# Altium project node24.PrjPcb (part 5 of 5)
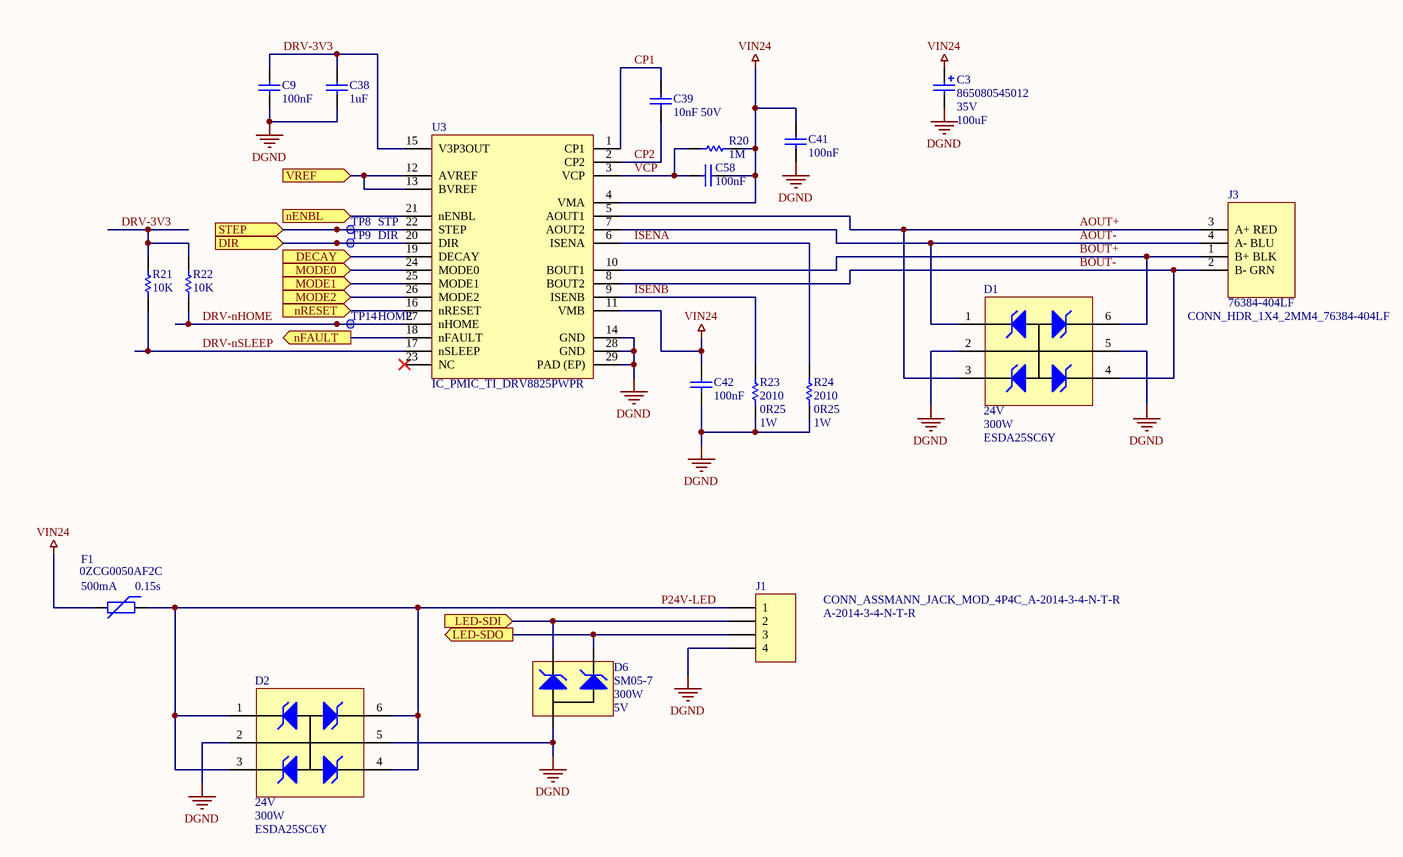
[diagram p6: node24-channel.SchDoc]

## Nets that join several sheets
DGND: node24-stm32f765bit6 (80 pins), node24-ethernet (22 pins), node24-power (19 pins), U_BANK-A (6 pins), U_BANK-A/U_CH-0 (16 pins), U_BANK-A/U_CH-4 (16 pins), U_BANK-A/U_CH-1 (16 pins), U_BANK-A/U_CH-5 (16 pins), U_BANK-A/U_CH-2 (16 pins), U_BANK-A/U_CH-6 (16 pins), U_BANK-A/U_CH-3 (16 pins), U_BANK-A/U_CH-7 (16 pins), U_BANK-B (6 pins), U_BANK-B/U_CH-0 (16 pins), U_BANK-B/U_CH-4 (16 pins), U_BANK-B/U_CH-1 (16 pins), U_BANK-B/U_CH-5 (16 pins), U_BANK-B/U_CH-2 (16 pins), U_BANK-B/U_CH-6 (16 pins), U_BANK-B/U_CH-3 (16 pins), U_BANK-B/U_CH-7 (16 pins), U_BANK-C (6 pins), U_BANK-C/U_CH-0 (16 pins), U_BANK-C/U_CH-4 (16 pins), U_BANK-C/U_CH-1 (16 pins), U_BANK-C/U_CH-5 (16 pins), U_BANK-C/U_CH-2 (16 pins), U_BANK-C/U_CH-6 (16 pins), U_BANK-C/U_CH-3 (16 pins), U_BANK-C/U_CH-7 (16 pins)
P3V3: node24-stm32f765bit6 (51 pins), node24-ethernet (8 pins), node24-power (5 pins), U_BANK-A (5 pins), U_BANK-B (5 pins), U_BANK-C (5 pins)
P5V0: node24-power (C47.1 C57.1 R2.2 U1.3), U_BANK-A (C14A.1 U4A.1), U_BANK-B (C14B.1 U4B.1), U_BANK-C (C14C.1 U4C.1)
VIN24: node24-power (8 pins), U_BANK-A/U_CH-0 (8 pins), U_BANK-A/U_CH-4 (8 pins), U_BANK-A/U_CH-1 (8 pins), U_BANK-A/U_CH-5 (8 pins), U_BANK-A/U_CH-2 (8 pins), U_BANK-A/U_CH-6 (8 pins), U_BANK-A/U_CH-3 (8 pins), U_BANK-A/U_CH-7 (8 pins), U_BANK-B/U_CH-0 (8 pins), U_BANK-B/U_CH-4 (8 pins), U_BANK-B/U_CH-1 (8 pins), U_BANK-B/U_CH-5 (8 pins), U_BANK-B/U_CH-2 (8 pins), U_BANK-B/U_CH-6 (8 pins), U_BANK-B/U_CH-3 (8 pins), U_BANK-B/U_CH-7 (8 pins), U_BANK-C/U_CH-0 (8 pins), U_BANK-C/U_CH-4 (8 pins), U_BANK-C/U_CH-1 (8 pins), U_BANK-C/U_CH-5 (8 pins), U_BANK-C/U_CH-2 (8 pins), U_BANK-C/U_CH-6 (8 pins), U_BANK-C/U_CH-3 (8 pins), U_BANK-C/U_CH-7 (8 pins)
DRV-BANKA-DECAY: node24-stm32f765bit6 (R48.2), U_BANK-A/U_CH-0 (U3A.19), U_BANK-A/U_CH-4 (U3B.19), U_BANK-A/U_CH-1 (U3C.19), U_BANK-A/U_CH-5 (U3D.19), U_BANK-A/U_CH-2 (U3E.19), U_BANK-A/U_CH-6 (U3F.19), U_BANK-A/U_CH-3 (U3G.19), U_BANK-A/U_CH-7 (U3H.19)
DRV-BANKA-DIR-0: node24-stm32f765bit6 (U2.164), U_BANK-A/U_CH-0 (TP9A.1 U3A.20)
DRV-BANKA-DIR-1: node24-stm32f765bit6 (U2.166), U_BANK-A/U_CH-1 (TP9C.1 U3C.20)
DRV-BANKA-DIR-2: node24-stm32f765bit6 (U2.168), U_BANK-A/U_CH-2 (TP9E.1 U3E.20)
DRV-BANKA-DIR-3: node24-stm32f765bit6 (U2.172), U_BANK-A/U_CH-3 (TP9G.1 U3G.20)
DRV-BANKA-DIR-4: node24-stm32f765bit6 (U2.108), U_BANK-A/U_CH-4 (TP9B.1 U3B.20)
DRV-BANKA-DIR-5: node24-stm32f765bit6 (U2.110), U_BANK-A/U_CH-5 (TP9D.1 U3D.20)
DRV-BANKA-DIR-6: node24-stm32f765bit6 (U2.112), U_BANK-A/U_CH-6 (TP9F.1 U3F.20)
DRV-BANKA-DIR-7: node24-stm32f765bit6 (U2.116), U_BANK-A/U_CH-7 (TP9H.1 U3H.20)
DRV-BANKA-MODE0: node24-stm32f765bit6 (R35.2), U_BANK-A/U_CH-0 (U3A.24), U_BANK-A/U_CH-4 (U3B.24), U_BANK-A/U_CH-1 (U3C.24), U_BANK-A/U_CH-5 (U3D.24), U_BANK-A/U_CH-2 (U3E.24), U_BANK-A/U_CH-6 (U3F.24), U_BANK-A/U_CH-3 (U3G.24), U_BANK-A/U_CH-7 (U3H.24)
DRV-BANKA-MODE1: node24-stm32f765bit6 (R39.2), U_BANK-A/U_CH-0 (U3A.25), U_BANK-A/U_CH-4 (U3B.25), U_BANK-A/U_CH-1 (U3C.25), U_BANK-A/U_CH-5 (U3D.25), U_BANK-A/U_CH-2 (U3E.25), U_BANK-A/U_CH-6 (U3F.25), U_BANK-A/U_CH-3 (U3G.25), U_BANK-A/U_CH-7 (U3H.25)
DRV-BANKA-MODE2: node24-stm32f765bit6 (R43.2), U_BANK-A/U_CH-0 (U3A.26), U_BANK-A/U_CH-4 (U3B.26), U_BANK-A/U_CH-1 (U3C.26), U_BANK-A/U_CH-5 (U3D.26), U_BANK-A/U_CH-2 (U3E.26), U_BANK-A/U_CH-6 (U3F.26), U_BANK-A/U_CH-3 (U3G.26), U_BANK-A/U_CH-7 (U3H.26)
DRV-BANKA-nENBL: node24-stm32f765bit6 (U2.102), U_BANK-A/U_CH-0 (U3A.21), U_BANK-A/U_CH-4 (U3B.21), U_BANK-A/U_CH-1 (U3C.21), U_BANK-A/U_CH-5 (U3D.21), U_BANK-A/U_CH-2 (U3E.21), U_BANK-A/U_CH-6 (U3F.21), U_BANK-A/U_CH-3 (U3G.21), U_BANK-A/U_CH-7 (U3H.21)
DRV-BANKA-nFAULT: node24-stm32f765bit6 (U2.161), U_BANK-A (R38A.1), U_BANK-A/U_CH-0 (U3A.18), U_BANK-A/U_CH-4 (U3B.18), U_BANK-A/U_CH-1 (U3C.18), U_BANK-A/U_CH-5 (U3D.18), U_BANK-A/U_CH-2 (U3E.18), U_BANK-A/U_CH-6 (U3F.18), U_BANK-A/U_CH-3 (U3G.18), U_BANK-A/U_CH-7 (U3H.18)
DRV-BANKA-nRESET: node24-stm32f765bit6 (U2.98), U_BANK-A/U_CH-0 (U3A.16), U_BANK-A/U_CH-4 (U3B.16), U_BANK-A/U_CH-1 (U3C.16), U_BANK-A/U_CH-5 (U3D.16), U_BANK-A/U_CH-2 (U3E.16), U_BANK-A/U_CH-6 (U3F.16), U_BANK-A/U_CH-3 (U3G.16), U_BANK-A/U_CH-7 (U3H.16)
DRV-BANKA-STEP-0: node24-stm32f765bit6 (U2.165), U_BANK-A/U_CH-0 (TP8A.1 U3A.22)
DRV-BANKA-STEP-1: node24-stm32f765bit6 (U2.167), U_BANK-A/U_CH-1 (TP8C.1 U3C.22)
DRV-BANKA-STEP-2: node24-stm32f765bit6 (U2.169), U_BANK-A/U_CH-2 (TP8E.1 U3E.22)
DRV-BANKA-STEP-3: node24-stm32f765bit6 (U2.173), U_BANK-A/U_CH-3 (TP8G.1 U3G.22)
DRV-BANKA-STEP-4: node24-stm32f765bit6 (U2.109), U_BANK-A/U_CH-4 (TP8B.1 U3B.22)
DRV-BANKA-STEP-5: node24-stm32f765bit6 (U2.111), U_BANK-A/U_CH-5 (TP8D.1 U3D.22)
DRV-BANKA-STEP-6: node24-stm32f765bit6 (U2.113), U_BANK-A/U_CH-6 (TP8F.1 U3F.22)
DRV-BANKA-STEP-7: node24-stm32f765bit6 (U2.117), U_BANK-A/U_CH-7 (TP8H.1 U3H.22)
DRV-BANKA-VREF: node24-stm32f765bit6 (R31.1), U_BANK-A/U_CH-0 (U3A.12 U3A.13), U_BANK-A/U_CH-4 (U3B.12 U3B.13), U_BANK-A/U_CH-1 (U3C.12 U3C.13), U_BANK-A/U_CH-5 (U3D.12 U3D.13), U_BANK-A/U_CH-2 (U3E.12 U3E.13), U_BANK-A/U_CH-6 (U3F.12 U3F.13), U_BANK-A/U_CH-3 (U3G.12 U3G.13), U_BANK-A/U_CH-7 (U3H.12 U3H.13)
DRV-BANKB-DECAY: node24-stm32f765bit6 (R49.2), U_BANK-B/U_CH-0 (U3I.19), U_BANK-B/U_CH-4 (U3J.19), U_BANK-B/U_CH-1 (U3K.19), U_BANK-B/U_CH-5 (U3L.19), U_BANK-B/U_CH-2 (U3M.19), U_BANK-B/U_CH-6 (U3N.19), U_BANK-B/U_CH-3 (U3O.19), U_BANK-B/U_CH-7 (U3P.19)
DRV-BANKB-DIR-0: node24-stm32f765bit6 (U2.200), U_BANK-B/U_CH-0 (TP9I.1 U3I.20)
DRV-BANKB-DIR-1: node24-stm32f765bit6 (U2.1), U_BANK-B/U_CH-1 (TP9K.1 U3K.20)
DRV-BANKB-DIR-2: node24-stm32f765bit6 (U2.3), U_BANK-B/U_CH-2 (TP9M.1 U3M.20)
DRV-BANKB-DIR-3: node24-stm32f765bit6 (U2.5), U_BANK-B/U_CH-3 (TP9O.1 U3O.20)
DRV-BANKB-DIR-4: node24-stm32f765bit6 (U2.80), U_BANK-B/U_CH-4 (TP9J.1 U3J.20)
DRV-BANKB-DIR-5: node24-stm32f765bit6 (U2.84), U_BANK-B/U_CH-5 (TP9L.1 U3L.20)
DRV-BANKB-DIR-6: node24-stm32f765bit6 (U2.86), U_BANK-B/U_CH-6 (TP9N.1 U3N.20)
DRV-BANKB-DIR-7: node24-stm32f765bit6 (U2.88), U_BANK-B/U_CH-7 (TP9P.1 U3P.20)
DRV-BANKB-MODE0: node24-stm32f765bit6 (R36.2), U_BANK-B/U_CH-0 (U3I.24), U_BANK-B/U_CH-4 (U3J.24), U_BANK-B/U_CH-1 (U3K.24), U_BANK-B/U_CH-5 (U3L.24), U_BANK-B/U_CH-2 (U3M.24), U_BANK-B/U_CH-6 (U3N.24), U_BANK-B/U_CH-3 (U3O.24), U_BANK-B/U_CH-7 (U3P.24)
DRV-BANKB-MODE1: node24-stm32f765bit6 (R40.2), U_BANK-B/U_CH-0 (U3I.25), U_BANK-B/U_CH-4 (U3J.25), U_BANK-B/U_CH-1 (U3K.25), U_BANK-B/U_CH-5 (U3L.25), U_BANK-B/U_CH-2 (U3M.25), U_BANK-B/U_CH-6 (U3N.25), U_BANK-B/U_CH-3 (U3O.25), U_BANK-B/U_CH-7 (U3P.25)
DRV-BANKB-MODE2: node24-stm32f765bit6 (R44.2), U_BANK-B/U_CH-0 (U3I.26), U_BANK-B/U_CH-4 (U3J.26), U_BANK-B/U_CH-1 (U3K.26), U_BANK-B/U_CH-5 (U3L.26), U_BANK-B/U_CH-2 (U3M.26), U_BANK-B/U_CH-6 (U3N.26), U_BANK-B/U_CH-3 (U3O.26), U_BANK-B/U_CH-7 (U3P.26)
DRV-BANKB-nENBL: node24-stm32f765bit6 (U2.151), U_BANK-B/U_CH-0 (U3I.21), U_BANK-B/U_CH-4 (U3J.21), U_BANK-B/U_CH-1 (U3K.21), U_BANK-B/U_CH-5 (U3L.21), U_BANK-B/U_CH-2 (U3M.21), U_BANK-B/U_CH-6 (U3N.21), U_BANK-B/U_CH-3 (U3O.21), U_BANK-B/U_CH-7 (U3P.21)
DRV-BANKB-nFAULT: node24-stm32f765bit6 (U2.162), U_BANK-B (R38B.1), U_BANK-B/U_CH-0 (U3I.18), U_BANK-B/U_CH-4 (U3J.18), U_BANK-B/U_CH-1 (U3K.18), U_BANK-B/U_CH-5 (U3L.18), U_BANK-B/U_CH-2 (U3M.18), U_BANK-B/U_CH-6 (U3N.18), U_BANK-B/U_CH-3 (U3O.18), U_BANK-B/U_CH-7 (U3P.18)
DRV-BANKB-nRESET: node24-stm32f765bit6 (U2.99), U_BANK-B/U_CH-0 (U3I.16), U_BANK-B/U_CH-4 (U3J.16), U_BANK-B/U_CH-1 (U3K.16), U_BANK-B/U_CH-5 (U3L.16), U_BANK-B/U_CH-2 (U3M.16), U_BANK-B/U_CH-6 (U3N.16), U_BANK-B/U_CH-3 (U3O.16), U_BANK-B/U_CH-7 (U3P.16)
DRV-BANKB-STEP-0: node24-stm32f765bit6 (U2.201), U_BANK-B/U_CH-0 (TP8I.1 U3I.22)
DRV-BANKB-STEP-1: node24-stm32f765bit6 (U2.2), U_BANK-B/U_CH-1 (TP8K.1 U3K.22)
DRV-BANKB-STEP-2: node24-stm32f765bit6 (U2.4), U_BANK-B/U_CH-2 (TP8M.1 U3M.22)
DRV-BANKB-STEP-3: node24-stm32f765bit6 (U2.79), U_BANK-B/U_CH-3 (TP8O.1 U3O.22)
DRV-BANKB-STEP-4: node24-stm32f765bit6 (U2.81), U_BANK-B/U_CH-4 (TP8J.1 U3J.22)
DRV-BANKB-STEP-5: node24-stm32f765bit6 (U2.85), U_BANK-B/U_CH-5 (TP8L.1 U3L.22)
DRV-BANKB-STEP-6: node24-stm32f765bit6 (U2.87), U_BANK-B/U_CH-6 (TP8N.1 U3N.22)
DRV-BANKB-STEP-7: node24-stm32f765bit6 (U2.89), U_BANK-B/U_CH-7 (TP8P.1 U3P.22)
DRV-BANKB-VREF: node24-stm32f765bit6 (R32.1), U_BANK-B/U_CH-0 (U3I.12 U3I.13), U_BANK-B/U_CH-4 (U3J.12 U3J.13), U_BANK-B/U_CH-1 (U3K.12 U3K.13), U_BANK-B/U_CH-5 (U3L.12 U3L.13), U_BANK-B/U_CH-2 (U3M.12 U3M.13), U_BANK-B/U_CH-6 (U3N.12 U3N.13), U_BANK-B/U_CH-3 (U3O.12 U3O.13), U_BANK-B/U_CH-7 (U3P.12 U3P.13)
DRV-BANKC-DECAY: node24-stm32f765bit6 (R50.2), U_BANK-C/U_CH-0 (U3Q.19), U_BANK-C/U_CH-4 (U3R.19), U_BANK-C/U_CH-1 (U3S.19), U_BANK-C/U_CH-5 (U3T.19), U_BANK-C/U_CH-2 (U3U.19), U_BANK-C/U_CH-6 (U3V.19), U_BANK-C/U_CH-3 (U3W.19), U_BANK-C/U_CH-7 (U3X.19)
DRV-BANKC-DIR-0: node24-stm32f765bit6 (U2.16), U_BANK-C/U_CH-0 (TP9Q.1 U3Q.20)
DRV-BANKC-DIR-1: node24-stm32f765bit6 (U2.18), U_BANK-C/U_CH-1 (TP9S.1 U3S.20)
DRV-BANKC-DIR-2: node24-stm32f765bit6 (U2.23), U_BANK-C/U_CH-2 (TP9U.1 U3U.20)
DRV-BANKC-DIR-3: node24-stm32f765bit6 (U2.27), U_BANK-C/U_CH-3 (TP9W.1 U3W.20)
DRV-BANKC-DIR-4: node24-stm32f765bit6 (U2.29), U_BANK-C/U_CH-4 (TP9R.1 U3R.20)
DRV-BANKC-DIR-5: node24-stm32f765bit6 (U2.31), U_BANK-C/U_CH-5 (TP9T.1 U3T.20)
DRV-BANKC-DIR-6: node24-stm32f765bit6 (U2.71), U_BANK-C/U_CH-6 (TP9V.1 U3V.20)
DRV-BANKC-DIR-7: node24-stm32f765bit6 (U2.75), U_BANK-C/U_CH-7 (TP9X.1 U3X.20)
DRV-BANKC-MODE0: node24-stm32f765bit6 (R37.2), U_BANK-C/U_CH-0 (U3Q.24), U_BANK-C/U_CH-4 (U3R.24), U_BANK-C/U_CH-1 (U3S.24), U_BANK-C/U_CH-5 (U3T.24), U_BANK-C/U_CH-2 (U3U.24), U_BANK-C/U_CH-6 (U3V.24), U_BANK-C/U_CH-3 (U3W.24), U_BANK-C/U_CH-7 (U3X.24)
DRV-BANKC-MODE1: node24-stm32f765bit6 (R41.2), U_BANK-C/U_CH-0 (U3Q.25), U_BANK-C/U_CH-4 (U3R.25), U_BANK-C/U_CH-1 (U3S.25), U_BANK-C/U_CH-5 (U3T.25), U_BANK-C/U_CH-2 (U3U.25), U_BANK-C/U_CH-6 (U3V.25), U_BANK-C/U_CH-3 (U3W.25), U_BANK-C/U_CH-7 (U3X.25)
DRV-BANKC-MODE2: node24-stm32f765bit6 (R45.2), U_BANK-C/U_CH-0 (U3Q.26), U_BANK-C/U_CH-4 (U3R.26), U_BANK-C/U_CH-1 (U3S.26), U_BANK-C/U_CH-5 (U3T.26), U_BANK-C/U_CH-2 (U3U.26), U_BANK-C/U_CH-6 (U3V.26), U_BANK-C/U_CH-3 (U3W.26), U_BANK-C/U_CH-7 (U3X.26)
DRV-BANKC-nENBL: node24-stm32f765bit6 (U2.152), U_BANK-C/U_CH-0 (U3Q.21), U_BANK-C/U_CH-4 (U3R.21), U_BANK-C/U_CH-1 (U3S.21), U_BANK-C/U_CH-5 (U3T.21), U_BANK-C/U_CH-2 (U3U.21), U_BANK-C/U_CH-6 (U3V.21), U_BANK-C/U_CH-3 (U3W.21), U_BANK-C/U_CH-7 (U3X.21)
DRV-BANKC-nFAULT: node24-stm32f765bit6 (U2.163), U_BANK-C (R38C.1), U_BANK-C/U_CH-0 (U3Q.18), U_BANK-C/U_CH-4 (U3R.18), U_BANK-C/U_CH-1 (U3S.18), U_BANK-C/U_CH-5 (U3T.18), U_BANK-C/U_CH-2 (U3U.18), U_BANK-C/U_CH-6 (U3V.18), U_BANK-C/U_CH-3 (U3W.18), U_BANK-C/U_CH-7 (U3X.18)
DRV-BANKC-nRESET: node24-stm32f765bit6 (U2.100), U_BANK-C/U_CH-0 (U3Q.16), U_BANK-C/U_CH-4 (U3R.16), U_BANK-C/U_CH-1 (U3S.16), U_BANK-C/U_CH-5 (U3T.16), U_BANK-C/U_CH-2 (U3U.16), U_BANK-C/U_CH-6 (U3V.16), U_BANK-C/U_CH-3 (U3W.16), U_BANK-C/U_CH-7 (U3X.16)
DRV-BANKC-STEP-0: node24-stm32f765bit6 (U2.17), U_BANK-C/U_CH-0 (TP8Q.1 U3Q.22)
DRV-BANKC-STEP-1: node24-stm32f765bit6 (U2.22), U_BANK-C/U_CH-1 (TP8S.1 U3S.22)
DRV-BANKC-STEP-2: node24-stm32f765bit6 (U2.24), U_BANK-C/U_CH-2 (TP8U.1 U3U.22)
DRV-BANKC-STEP-3: node24-stm32f765bit6 (U2.28), U_BANK-C/U_CH-3 (TP8W.1 U3W.22)
DRV-BANKC-STEP-4: node24-stm32f765bit6 (U2.30), U_BANK-C/U_CH-4 (TP8R.1 U3R.22)
DRV-BANKC-STEP-5: node24-stm32f765bit6 (U2.70), U_BANK-C/U_CH-5 (TP8T.1 U3T.22)
DRV-BANKC-STEP-6: node24-stm32f765bit6 (U2.74), U_BANK-C/U_CH-6 (TP8V.1 U3V.22)
DRV-BANKC-STEP-7: node24-stm32f765bit6 (U2.76), U_BANK-C/U_CH-7 (TP8X.1 U3X.22)
DRV-BANKC-VREF: node24-stm32f765bit6 (R33.1), U_BANK-C/U_CH-0 (U3Q.12 U3Q.13), U_BANK-C/U_CH-4 (U3R.12 U3R.13), U_BANK-C/U_CH-1 (U3S.12 U3S.13), U_BANK-C/U_CH-5 (U3T.12 U3T.13), U_BANK-C/U_CH-2 (U3U.12 U3U.13), U_BANK-C/U_CH-6 (U3V.12 U3V.13), U_BANK-C/U_CH-3 (U3W.12 U3W.13), U_BANK-C/U_CH-7 (U3X.12 U3X.13)
ETH-CRS-DV: node24-stm32f765bit6 (U2.56), node24-ethernet (R9.1)
ETH-MDC: node24-stm32f765bit6 (U2.36), node24-ethernet (U9.13)
ETH-MDIO: node24-stm32f765bit6 (U2.45), node24-ethernet (R11.2 U9.12)
ETH-REF-CLK: node24-stm32f765bit6 (U2.44), node24-ethernet (R12.1)
ETH-RXD0: node24-stm32f765bit6 (U2.57), node24-ethernet (R5.1)
ETH-RXD1: node24-stm32f765bit6 (U2.58), node24-ethernet (R6.1)
ETH-TX-EN: node24-stm32f765bit6 (U2.91), node24-ethernet (U9.16)
ETH-TXD0: node24-stm32f765bit6 (U2.104), node24-ethernet (U9.17)
ETH-TXD1: node24-stm32f765bit6 (U2.105), node24-ethernet (U9.18)
LED-5V-MOSI-0_U_BANK-A: U_BANK-A (U4A.3), U_BANK-A/U_CH-0 (D6A.1 J1A.2)
LED-5V-MOSI-0_U_BANK-B: U_BANK-B (U4B.3), U_BANK-B/U_CH-0 (D6I.1 J1I.2)
LED-5V-MOSI-0_U_BANK-C: U_BANK-C (U4C.3), U_BANK-C/U_CH-0 (D6Q.1 J1Q.2)
LED-5V-MOSI-1_U_BANK-A: U_BANK-A (R57A.2 U4A.4), U_BANK-A/U_CH-1 (D6C.1 J1C.2)
LED-5V-MOSI-1_U_BANK-B: U_BANK-B (R57B.2 U4B.4), U_BANK-B/U_CH-1 (D6K.1 J1K.2)
LED-5V-MOSI-1_U_BANK-C: U_BANK-C (R57C.2 U4C.4), U_BANK-C/U_CH-1 (D6S.1 J1S.2)
LED-5V-MOSI-2_U_BANK-A: U_BANK-A (R58A.2 U4A.5), U_BANK-A/U_CH-2 (D6E.1 J1E.2)
LED-5V-MOSI-2_U_BANK-B: U_BANK-B (R58B.2 U4B.5), U_BANK-B/U_CH-2 (D6M.1 J1M.2)
LED-5V-MOSI-2_U_BANK-C: U_BANK-C (R58C.2 U4C.5), U_BANK-C/U_CH-2 (D6U.1 J1U.2)
LED-5V-MOSI-3_U_BANK-A: U_BANK-A (R59A.2 U4A.6), U_BANK-A/U_CH-3 (D6G.1 J1G.2)
LED-5V-MOSI-3_U_BANK-B: U_BANK-B (R59B.2 U4B.6), U_BANK-B/U_CH-3 (D6O.1 J1O.2)
LED-5V-MOSI-3_U_BANK-C: U_BANK-C (R59C.2 U4C.6), U_BANK-C/U_CH-3 (D6W.1 J1W.2)
LED-5V-MOSI-4_U_BANK-A: U_BANK-A (R60A.2 U4A.7), U_BANK-A/U_CH-4 (D6B.1 J1B.2)
LED-5V-MOSI-4_U_BANK-B: U_BANK-B (R60B.2 U4B.7), U_BANK-B/U_CH-4 (D6J.1 J1J.2)
LED-5V-MOSI-4_U_BANK-C: U_BANK-C (R60C.2 U4C.7), U_BANK-C/U_CH-4 (D6R.1 J1R.2)
LED-5V-MOSI-5_U_BANK-A: U_BANK-A (R61A.2 U4A.8), U_BANK-A/U_CH-5 (D6D.1 J1D.2)
LED-5V-MOSI-5_U_BANK-B: U_BANK-B (R61B.2 U4B.8), U_BANK-B/U_CH-5 (D6L.1 J1L.2)
LED-5V-MOSI-5_U_BANK-C: U_BANK-C (R61C.2 U4C.8), U_BANK-C/U_CH-5 (D6T.1 J1T.2)
LED-5V-MOSI-6_U_BANK-A: U_BANK-A (R62A.2 U4A.9), U_BANK-A/U_CH-6 (D6F.1 J1F.2)
LED-5V-MOSI-6_U_BANK-B: U_BANK-B (R62B.2 U4B.9), U_BANK-B/U_CH-6 (D6N.1 J1N.2)
LED-5V-MOSI-6_U_BANK-C: U_BANK-C (R62C.2 U4C.9), U_BANK-C/U_CH-6 (D6V.1 J1V.2)
LED-5V-MOSI-7_U_BANK-A: U_BANK-A (R63A.2 U4A.10), U_BANK-A/U_CH-7 (D6H.1 J1H.2)
LED-5V-MOSI-7_U_BANK-B: U_BANK-B (R63B.2 U4B.10), U_BANK-B/U_CH-7 (D6P.1 J1P.2)
LED-5V-MOSI-7_U_BANK-C: U_BANK-C (R63C.2 U4C.10), U_BANK-C/U_CH-7 (D6X.1 J1X.2)
LED-BANKA-MOSI-0: node24-stm32f765bit6 (U2.154), U_BANK-A (U4A.21)
LED-BANKA-MOSI-1: node24-stm32f765bit6 (U2.155), U_BANK-A (U4A.20)
LED-BANKA-MOSI-2: node24-stm32f765bit6 (U2.156), U_BANK-A (U4A.19)
LED-BANKA-MOSI-3: node24-stm32f765bit6 (U2.157), U_BANK-A (U4A.18)
LED-BANKA-MOSI-4: node24-stm32f765bit6 (U2.205), U_BANK-A (U4A.17)
LED-BANKA-MOSI-5: node24-stm32f765bit6 (U2.206), U_BANK-A (U4A.16)
LED-BANKA-MOSI-6: node24-stm32f765bit6 (U2.207), U_BANK-A (U4A.15)
LED-BANKA-MOSI-7: node24-stm32f765bit6 (U2.208), U_BANK-A (U4A.14)
LED-BANKA-nOE: node24-stm32f765bit6 (U2.138), U_BANK-A (R16A.1 U4A.22)
LED-BANKB-MOSI-0: node24-stm32f765bit6 (U2.7), U_BANK-B (U4B.21)
LED-BANKB-MOSI-1: node24-stm32f765bit6 (U2.11), U_BANK-B (U4B.20)
LED-BANKB-MOSI-2: node24-stm32f765bit6 (U2.12), U_BANK-B (U4B.19)
LED-BANKB-MOSI-3: node24-stm32f765bit6 (U2.13), U_BANK-B (U4B.18)
LED-BANKB-MOSI-4: node24-stm32f765bit6 (U2.19), U_BANK-B (U4B.17)
LED-BANKB-MOSI-5: node24-stm32f765bit6 (U2.20), U_BANK-B (U4B.16)
LED-BANKB-MOSI-6: node24-stm32f765bit6 (U2.21), U_BANK-B (U4B.15)
LED-BANKB-MOSI-7: node24-stm32f765bit6 (U2.64), U_BANK-B (U4B.14)
LED-BANKB-nOE: node24-stm32f765bit6 (U2.139), U_BANK-B (R16B.1 U4B.22)
LED-BANKC-MOSI-0: node24-stm32f765bit6 (U2.65), U_BANK-C (U4C.21)
LED-BANKC-MOSI-1: node24-stm32f765bit6 (U2.66), U_BANK-C (U4C.20)
LED-BANKC-MOSI-2: node24-stm32f765bit6 (U2.67), U_BANK-C (U4C.19)
LED-BANKC-MOSI-3: node24-stm32f765bit6 (U2.68), U_BANK-C (U4C.18)
LED-BANKC-MOSI-4: node24-stm32f765bit6 (U2.69), U_BANK-C (U4C.17)
LED-BANKC-MOSI-5: node24-stm32f765bit6 (U2.95), U_BANK-C (U4C.16)
LED-BANKC-MOSI-6: node24-stm32f765bit6 (U2.118), U_BANK-C (U4C.15)
LED-BANKC-MOSI-7: node24-stm32f765bit6 (U2.119), U_BANK-C (U4C.14)
LED-BANKC-nOE: node24-stm32f765bit6 (U2.140), U_BANK-C (R16C.1 U4C.22)
NetD6A_2: U_BANK-A (R57A.1), U_BANK-A/U_CH-0 (D6A.2 J1A.3)
NetD6B_2: U_BANK-A (R61A.1), U_BANK-A/U_CH-4 (D6B.2 J1B.3)
NetD6C_2: U_BANK-A (R58A.1), U_BANK-A/U_CH-1 (D6C.2 J1C.3)
NetD6D_2: U_BANK-A (R62A.1), U_BANK-A/U_CH-5 (D6D.2 J1D.3)
NetD6E_2: U_BANK-A (R59A.1), U_BANK-A/U_CH-2 (D6E.2 J1E.3)
NetD6F_2: U_BANK-A (R63A.1), U_BANK-A/U_CH-6 (D6F.2 J1F.3)
NetD6G_2: U_BANK-A (R60A.1), U_BANK-A/U_CH-3 (D6G.2 J1G.3)
NetD6H_2: U_BANK-A (TP13A.1), U_BANK-A/U_CH-7 (D6H.2 J1H.3)
NetD6I_2: U_BANK-B (R57B.1), U_BANK-B/U_CH-0 (D6I.2 J1I.3)
NetD6J_2: U_BANK-B (R61B.1), U_BANK-B/U_CH-4 (D6J.2 J1J.3)
NetD6K_2: U_BANK-B (R58B.1), U_BANK-B/U_CH-1 (D6K.2 J1K.3)
NetD6L_2: U_BANK-B (R62B.1), U_BANK-B/U_CH-5 (D6L.2 J1L.3)
NetD6M_2: U_BANK-B (R59B.1), U_BANK-B/U_CH-2 (D6M.2 J1M.3)
NetD6N_2: U_BANK-B (R63B.1), U_BANK-B/U_CH-6 (D6N.2 J1N.3)
NetD6O_2: U_BANK-B (R60B.1), U_BANK-B/U_CH-3 (D6O.2 J1O.3)
NetD6P_2: U_BANK-B (TP13B.1), U_BANK-B/U_CH-7 (D6P.2 J1P.3)
NetD6Q_2: U_BANK-C (R57C.1), U_BANK-C/U_CH-0 (D6Q.2 J1Q.3)
NetD6R_2: U_BANK-C (R61C.1), U_BANK-C/U_CH-4 (D6R.2 J1R.3)
NetD6S_2: U_BANK-C (R58C.1), U_BANK-C/U_CH-1 (D6S.2 J1S.3)
NetD6T_2: U_BANK-C (R62C.1), U_BANK-C/U_CH-5 (D6T.2 J1T.3)
NetD6U_2: U_BANK-C (R59C.1), U_BANK-C/U_CH-2 (D6U.2 J1U.3)
NetD6V_2: U_BANK-C (R63C.1), U_BANK-C/U_CH-6 (D6V.2 J1V.3)
NetD6W_2: U_BANK-C (R60C.1), U_BANK-C/U_CH-3 (D6W.2 J1W.3)
NetD6X_2: U_BANK-C (TP13C.1), U_BANK-C/U_CH-7 (D6X.2 J1X.3)
nRST: node24-stm32f765bit6 (C31.2 R27.1 R52.1 U2.34), node24-ethernet (U9.15)

## Assembly variants
DEV: not fitted C35 J7 R1 R28 R57A R57B R57C R58A R58B R58C R59A R59B R59C R60A R60B R60C R61A R61B R61C R62A R62B R62C R63A R63B R63C